# Altium schematic sheet [01] Top.SchDoc
size 297 x 209 mm; CompanyName: Elkorch Mehdi; Engineer: Mehdi El Korch; Address1: Eckernförde str.20e; Address2: 24103 Kiel; Address3: Germany; DocumentNumber: 1; SheetNumber: 1; SheetTotal: 1; CreatedBy: Mehdi Elkorch
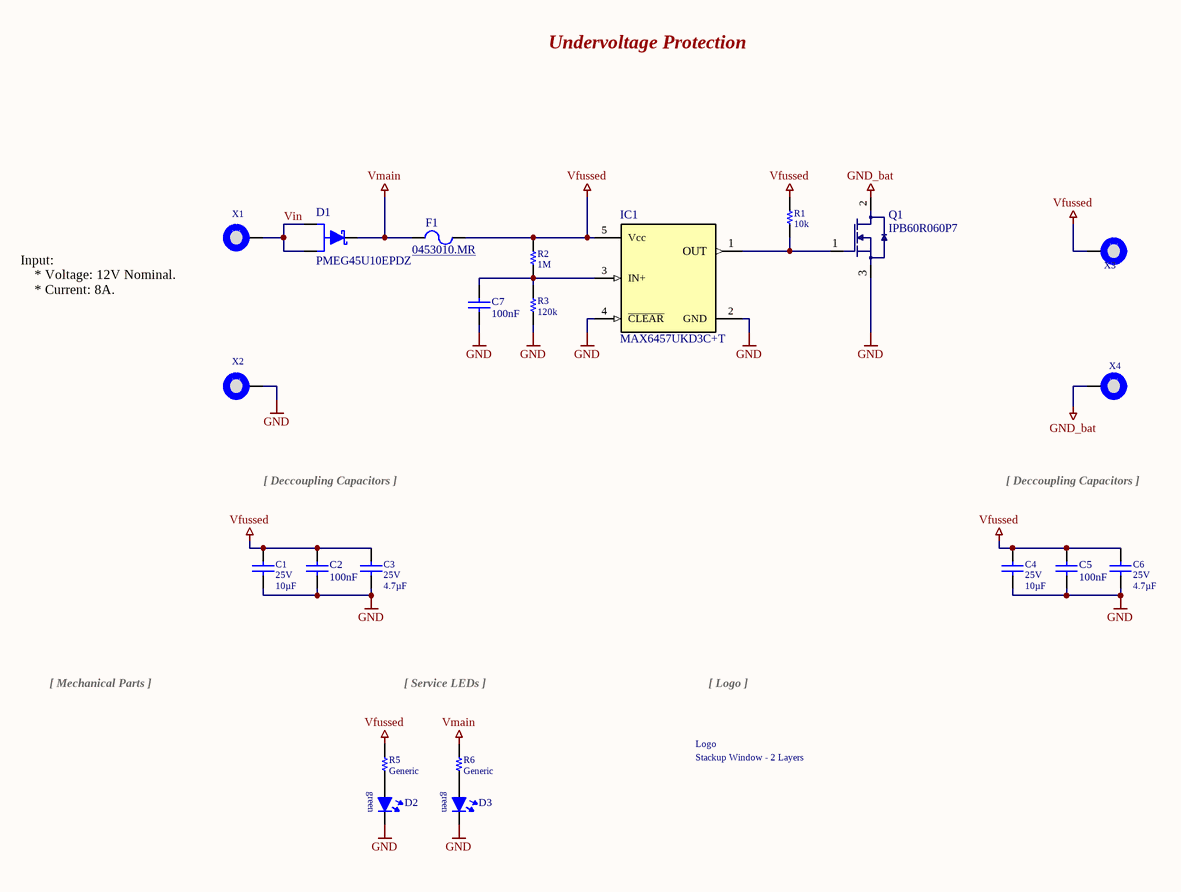
[diagram p0: [01] Top.SchDoc]

## Parts
A1  Logo_Mehdi  [LOGO_MEHDI]  (value not drawn)  (no BOM)
A2  Stackup Window - 2 Layers  [LAYER_WINDOW_2_LAYERS]  (value not drawn)  (no BOM)
C1  value 10µF  Voltage: 25V  [CAPC1210(3225)280_N]  (hidden comment: CAP-X7R_1210_25V_10uF)
C2  value 100nF  [CAPC0603(1608)100_N]  (hidden comment: CAP-X7R_0603_50V_Generic)
C3  value 4.7µF  Voltage: 25V  [CAPC3225X20N]  (hidden comment: CAP-X7R_1210_25V_4.7uF)
C4  value 10µF  Voltage: 25V  [CAPC1210(3225)280_N]  (hidden comment: CAP-X7R_1210_25V_10uF)
C5  value 100nF  [CAPC0603(1608)100_N]  (hidden comment: CAP-X7R_0603_50V_Generic)
C6  value 4.7µF  Voltage: 25V  [CAPC3225X20N]  (hidden comment: CAP-X7R_1210_25V_4.7uF)
C7  value 100nF  [CAPC0603(1608)100_N]  (hidden comment: CAP-X7R_0603_50V_Generic)
D1  PMEG45U10EPDZ  [DPAK213P650X82-3N]
D2  LG L29K-G2J1-24-Z  [SODFL170X85-2N]  (value not drawn)
D3  LG L29K-G2J1-24-Z  [SODFL170X85-2N]  (value not drawn)
F1  0453010.MR  [6.10x2.69mm]
IC1  MAX6457UKD3C+T  [SOT95P280X125-5N]
Q1  IPB60R060P7  [TO263-3]
R1  value 10k  [RESC0603(1608)_N]  (hidden comment: RES-0603_Generic)
R2  value 1M  [RESC0603(1608)_N]  (hidden comment: RES-0603_Generic)
R3  value 120k  [RESC0603(1608)_N]  (hidden comment: RES-0603_Generic)
R5  value Generic  [RESC0603(1608)_N]  (hidden comment: RES-0603_Generic)
R6  value Generic  [RESC0603(1608)_N]  (hidden comment: RES-0603_Generic)
X1  SolderPad_6/3.2  [SPAD_6/3.2]  (value not drawn)  (no BOM)
X2  SolderPad_6/3.2  [SPAD_6/3.2]  (value not drawn)  (no BOM)
X3  SolderPad_6/3.2  [SPAD_6/3.2]  (value not drawn)  (no BOM)
X4  SolderPad_6/3.2  [SPAD_6/3.2]  (value not drawn)  (no BOM)

## Nets
GND: C1.1 C2.1 C3.1 C4.1 C5.1 C6.1 C7.1 D2.1(K) D3.1(K) IC1.2(GND) IC1.4(~{CLEAR}) Q1.3(S) R3.1 X2.1
GND_bat: Q1.2(D) X4.1
Vfussed: C1.2 C2.2 C3.2 C4.2 C5.2 C6.2 F1.2 IC1.5(Vcc) R1.1 R2.1 R5.2 X3.1
Vmain: D1.3(K) F1.1 R6.2
Vin: D1.1(A) D1.2(A) X1.1
NetC7_2: C7.2 IC1.3(IN+) R2.2 R3.2
NetD2_2: D2.2(A) R5.1
NetD3_2: D3.2(A) R6.1
NetIC1_1: IC1.1(OUT) Q1.1(G) R1.2

## Notes on the sheet
- Undervoltage Protection
- Input:
  * Voltage: 12V Nominal.
  * Current: 8A.
- [ Deccoupling Capacitors ]
- [ Mechanical Parts ]
- [ Service LEDs ]
- [ Logo ]
- *NP: part not placed
- Part:
- Schutzvermerk nach ISO 16016 beachten
- Project:
- Project-File:
- Name
- Date
- Variant:
- last changed:
- Author
- Checked
- Rev.:
- Page/of:
- /
- (in symbol LG L29K-G2J1-24-Z) green
- (in symbol Logo_Mehdi) Logo

## Library data of the parts
A1 = Logo_Mehdi: Logo Mehdi
A2 = Stackup Window - 2 Layers: Layer Stackup Window for 2 Layers (Top, Bottom)
C1 C4 = CAP-X7R_1210_25V_10uF: Capacitor; ExactPartNumber: no; SMD/THT: SMD; SubType: X7R; Tolerance: 20%; DesignedBy: Wilhelm Stellmach; OpTempMax: 125; OpTempMin: -55; PackageReference: EIA 1210; LatestRevisionDate: 03.07.2019; PublishedDate: 03.07.2019; Publisher: General Acoustics e.K; ComponentLink1Description: Datasheet; RoHS: yes
C2 C5 C7 = CAP-X7R_0603_50V_Generic: Capacitor; ExactPartNumber: no; SMD/THT: SMD; SubType: X7R; Tolerance: 10%; Voltage: 50V; DesignedBy: Wilhelm Stellmach; PackageReference: EIA 0603; LatestRevisionDate: 18.10.2017; PublishedDate: 18.10.2017; Publisher: General Acoustics e.K; ComponentLink1Description: Datasheet; RoHS: yes
C3 C6 = CAP-X7R_1210_25V_4.7uF: Capacitor; ExactPartNumber: no; SMD/THT: SMD; SubType: X7R; Tolerance: 10%; DesignedBy: Wilhelm Stellmach; PackageReference: EIA 1210; LatestRevisionDate: 02.07.2019; PublishedDate: 02.07.2019; Publisher: General Acoustics e.K; ComponentLink1Description: Datasheet; RoHS: yes
D1 = PMEG45U10EPDZ: Shottky, 45 V, 10 A extremely low Vf barrier rectifier; Manufacturer 1: NXP Semiconductors; Average Rectified Current: 10A; Reverse Recovery Time: 34ns; Element Configuration: Common Anode; Peak Non-Repetitive Surge Current: 180A; Forward Voltage: 490mV; Max Reverse Voltage (DC): 45V; DesignedBy: Mehdi EL Korch; Supplier 1: Digi-Key; RoHS: Yes; Category: Schottky Diodes; Stock 1: 459; Mount: Surface Mount; Case/Package: SMD/SMT; Number of Pins: 3; Min Operating Temperature: -55°C; Max Operating Temperature: 150°C; Packaging: Tape and Reel; ComponentLink1URL: http://components.arrow.com/part/dataview/65320857S809267N9188?src-supplier=Arrow+Electronics; ComponentLink1Description: http://components.arrow.com/part/dataview/65320857S809267N9188?src-supplier=Arrow+Electronics; ComponentLink2URL: http://www.nxp.com/documents/data_sheet/PMEG45U10EPD.pdf?src-supplier=Avnet; ComponentLink2Description: http://www.nxp.com/documents/data_sheet/PMEG45U10EPD.pdf?src-supplier=Avnet; ComponentLink3URL: https://assets.nexperia.com/documents/data-sheet/PMEG45U10EPD.pdf?src-supplier=Digi-Key; ComponentLink3Description: https://assets.nexperia.com/documents/data-sheet/PMEG45U10EPD.pdf?src-supplier=Digi-Key; Supplier Part Number 1: 1727-1833-1-ND; Publisher: Mehdi El Korch; PublishedDate: 19.01.2022; LatestRevisionDate: 19.01.2022; Manufacturer Part Number 1: PMEG45U10EPDZ
D2 D3 = LG L29K-G2J1-24-Z: LED green 570nm, 4lm/W, 2.2...5.6mcd at 2mA, 3.4mW SmartLED; ExactPartNumber: yes; Manufacturer: OSRAM Opto Semiconductors; ManufacturerPartNumber: LG 29K-G2J1-24; SMD/THT: SMD; Voltage: 1.7V; DesignedBy: Marcus Schoeling; State: Proven; PackageReference: EIA 0603; SubType: LED; LatestRevisionDate: 19.11.2021; PublishedDate: 19.06.2019; Publisher: General Acoustics; ComponentLink1Description: Datasheet; ComponentLink1URL: https://dammedia.osram.info/media/resource/hires/osram-dam-5662670/LG%20L29K_EN.pdf; Pricing: 1=0.463, 10=0.332, 25=0.272, 100=0.217 (EUR); RoHS: yes; Supplier 1: Mouser; Supplier Part Number 1: 720-LGL29KG2J124Z
F1 = 0453010.MR: Fuse Chip Very Fast Acting 10A 125V SMD Solder Pad 2410 Ceramic T/R Automotive CE/CSA/PSE/UL; Manufacturer 1: Littelfuse; Resistance: 5.6mR; Fuse Type: Board Mount (Cartridge Style Excluded); Approvals: UL,CSA,PSE; DesignedBy: Mehdi El Korch; Supplier 1: Digi-Key; RoHS: Yes; Category: Fuses; Stock 1: 3711; Mount: Surface Mount; Case/Package: SMD/SMT; Number of Pins: 2; Housing Material: Ceramic; Min Operating Temperature: -55°C; Max Operating Temperature: 125°C; Current Rating: 10A; Packaging: Tape and Reel; Voltage Rating (DC): 125V; Voltage Rating (AC): 125V; Package Quantity: 1000; DC Cold Resistance: 5.6mR; Fuse Current: 10A; Working Voltage: 125V; Series: 453; Length: 6.1mm; Width: 0.106inch; Height: 0.106inch; Depth: 2.69mm; Size: 2.69mm; Radiation Hardening: No; REACH SVHC: No SVHC; Lead Free: Lead Free; RoHS Compliant: Yes; ComponentLink1URL: https://datasheet.ciiva.com/26923/getdatasheetpartid-759298-26923394.pdf?src-supplier=Verical; ComponentLink1Description: https://datasheet.ciiva.com/26923/getdatasheetpartid-759298-26923394.pdf?src-supplier=Verical; ComponentLink2URL: https://datasheet.ciiva.com/1549/littelfuse-fuse-451-453-1549624.pdf?src-supplier=Element14; ComponentLink2Description: https://datasheet.ciiva.com/1549/littelfuse-fuse-451-453-1549624.pdf?src-supplier=Element14; ComponentLink3URL: https://datasheet.ciiva.com/300/littelfuse-fuse-451-453-300025.pdf?src-supplier=Digi-Key; ComponentLink3Description: https://datasheet.ciiva.com/300/littelfuse-fuse-451-453-300025.pdf?src-supplier=Digi-Key; ComponentLink4URL: https://datasheet.ciiva.com/46394/1788341-46394809.pdf?src-supplier=Element14; ComponentLink4Description: https://datasheet.ciiva.com/46394/1788341-46394809.pdf?src-supplier=Element14; ComponentLink5URL: https://datasheet.ciiva.com/300/littelfuse-fuse-451-453-300026.pdf?src-supplier=Digi-Key; ComponentLink5Description: https://datasheet.ciiva.com/300/littelfuse-fuse-451-453-300026.pdf?src-supplier=Digi-Key; ComponentLink6URL: https://datasheet.ciiva.com/16378/451-453-16378314.pdf?src-supplier=Future+Electronics; ComponentLink6Description: https://datasheet.ciiva.com/16378/451-453-16378314.pdf?src-supplier=Future+Electronics; ComponentLink7URL: https://datasheet.ciiva.com/26828/getdatasheetpartid-107149-26828650.pdf?src-supplier=Verical; ComponentLink7Description: https://datasheet.ciiva.com/26828/getdatasheetpartid-107149-26828650.pdf?src-supplier=Verical; ComponentLink8URL: https://datasheet.ciiva.com/300/littelfuse-fuse-451-453-300027.pdf?src-supplier=Digi-Key; ComponentLink8Description: https://datasheet.ciiva.com/300/littelfuse-fuse-451-453-300027.pdf?src-supplier=Digi-Key; Supplier Part Number 1: F3141CT-ND; Publisher: Mehdi El Korch; PublishedDate: 15.01.2022; LatestRevisionDate: 15.01.2022; Manufacturer Part Number 1: 0453010.MR
IC1 = MAX6457UKD3C+T: Volt Supervisor Monitor 4V to 28V 5-Pin SOT-23 T/R; Manufacturer 1: Maxim; Max Power Dissipation: 571mW; Watchdog Timer: No; Min Reset Threshold Voltage: 1.071V; Max Reset Threshold Voltage: 1.151V; Number of Voltages Monitored: 1; Reset: Active Low; Operating Supply Current: 6.5uA; Reset Timeout: 90ms; DesignedBy: Mehdi EL korch; Supplier 1: RSComponents; RoHS: Yes; Category: Voltage Supervisors; Stock 1: 430; Pricing 1: 5=3,42200, 10=3,07600, 25=2,92400, 100=2,40000, 250=2,14400 (EUR); Mount: Surface Mount; Case/Package: SOT-23; Number of Pins: 5; Min Operating Temperature: -40°C; Max Operating Temperature: 125°C; Min Supply Voltage: 4V; Max Supply Voltage: 28V; Packaging: Cut Tape; Type: Simple Reset/Power-On Reset; Series: MAX6457, MAX6458, MAX6459, MAX6460; Package Quantity: 2500; Overvoltage Threshold: 1.151V; Undervoltage Threshold: 1.071V; Threshold Voltage: 1.151V; Nominal Supply Current: 6.5uA; Supply Current: 6.5uA; Radiation Hardening: No; RoHS Compliant: Yes; Lead Free: Lead Free; REACH SVHC: Unknown; ComponentLink1URL: https://datasheet.ciiva.com/1178/max6457-max6460-1178848.pdf?src-supplier=Newark; ComponentLink1Description: https://datasheet.ciiva.com/1178/max6457-max6460-1178848.pdf?src-supplier=Newark; ComponentLink2URL: https://datasheet.ciiva.com/1972/max6457-max6460-1972992.pdf?src-supplier=Digi-Key; ComponentLink2Description: https://datasheet.ciiva.com/1972/max6457-max6460-1972992.pdf?src-supplier=Digi-Key; ComponentLink3URL: https://datasheet.ciiva.com/1972/max6457-max6460-1972993.pdf?src-supplier=Digi-Key; ComponentLink3Description: https://datasheet.ciiva.com/1972/max6457-max6460-1972993.pdf?src-supplier=Digi-Key; ComponentLink4URL: https://datasheet.ciiva.com/1972/max6457-max6460-1972994.pdf?src-supplier=Digi-Key; ComponentLink4Description: https://datasheet.ciiva.com/1972/max6457-max6460-1972994.pdf?src-supplier=Digi-Key; ComponentLink5URL: https://datasheet.ciiva.com/14376/max6457-max6460-14376405.pdf?src-supplier=Avnet; ComponentLink5Description: https://datasheet.ciiva.com/14376/max6457-max6460-14376405.pdf?src-supplier=Avnet; Supplier Part Number 1: 1913670; Publisher: Mehdi EL Korch; PublishedDate: 14.01.2022; LatestRevisionDate: 14.01.2022; Manufacturer Part Number 1: MAX6457UKD3C+T
Q1 = IPB60R060P7: MOSFET, N-CH, 600V, 48A, 151A Pulse, 50mOhm, Qg 67nC; ExactPartNumber: yes; Manufacturer: Infineon; SMD/THT: SMD; DesignedBy: Wilhelm Stellmach; PackageReference: TO263-3; LatestRevisionDate: 15.05.2018; PublishedDate: 15.05.2018; Publisher: General Acoustics; ComponentLink1Description: Datasheet; ComponentLink1URL: https://www.infineon.com/dgdl/Infineon-IPB60R060P7-DS-v02_00-EN.pdf?fileId=5546d4625ee5d4cd015f2a6b797c047f; Pricing: 1=6.38, 10=5.694, 100=4.6693, 500=3.78096 (EUR); RoHS: yes; Supplier 1: Digi-Key; Supplier Part Number 1: IPB60R060P7ATMA1CT-ND; ManufacturerPartNumber: IPB60R060P7
R1-R3 R5 R6 = RES-0603_Generic: Resistor; ExactPartNumber: no; SMD/THT: SMD; SubType: 1/10 W; Tolerance: 1%; DesignedBy: Wilhelm Stellmach; PackageReference: EIA 0603; LatestRevisionDate: 18.10.2017; PublishedDate: 18.10.2017; Publisher: General Acoustics e.K; ComponentLink1Description: Datasheet; RoHS: yes
X1-X4 = SolderPad_6/3.2: Solder Pad, 6mm copper, 3.2mm hole; ExactPartNumber: no; SMD/THT: SMD; DesignedBy: Wilhelm Stellmach; LatestRevisionDate: 06.06.2019; PublishedDate: 06.06.2019; Publisher: General Acoustics e.K.; ComponentLink1Description: Datasheet; ComponentLink1URL: http://www.fischerelektronik.de/web_fischer/de_DE/Steckverbinder/G01/Stiftleisten/PR/SL%2011%20SMD%20062%204/$productCard/parameters/datasheet.xhtml; RoHS: yes; ManufacturerPartNumber: 6/3.2